# EAGLE design dspic-servo-2 (EAGLE 4.13)
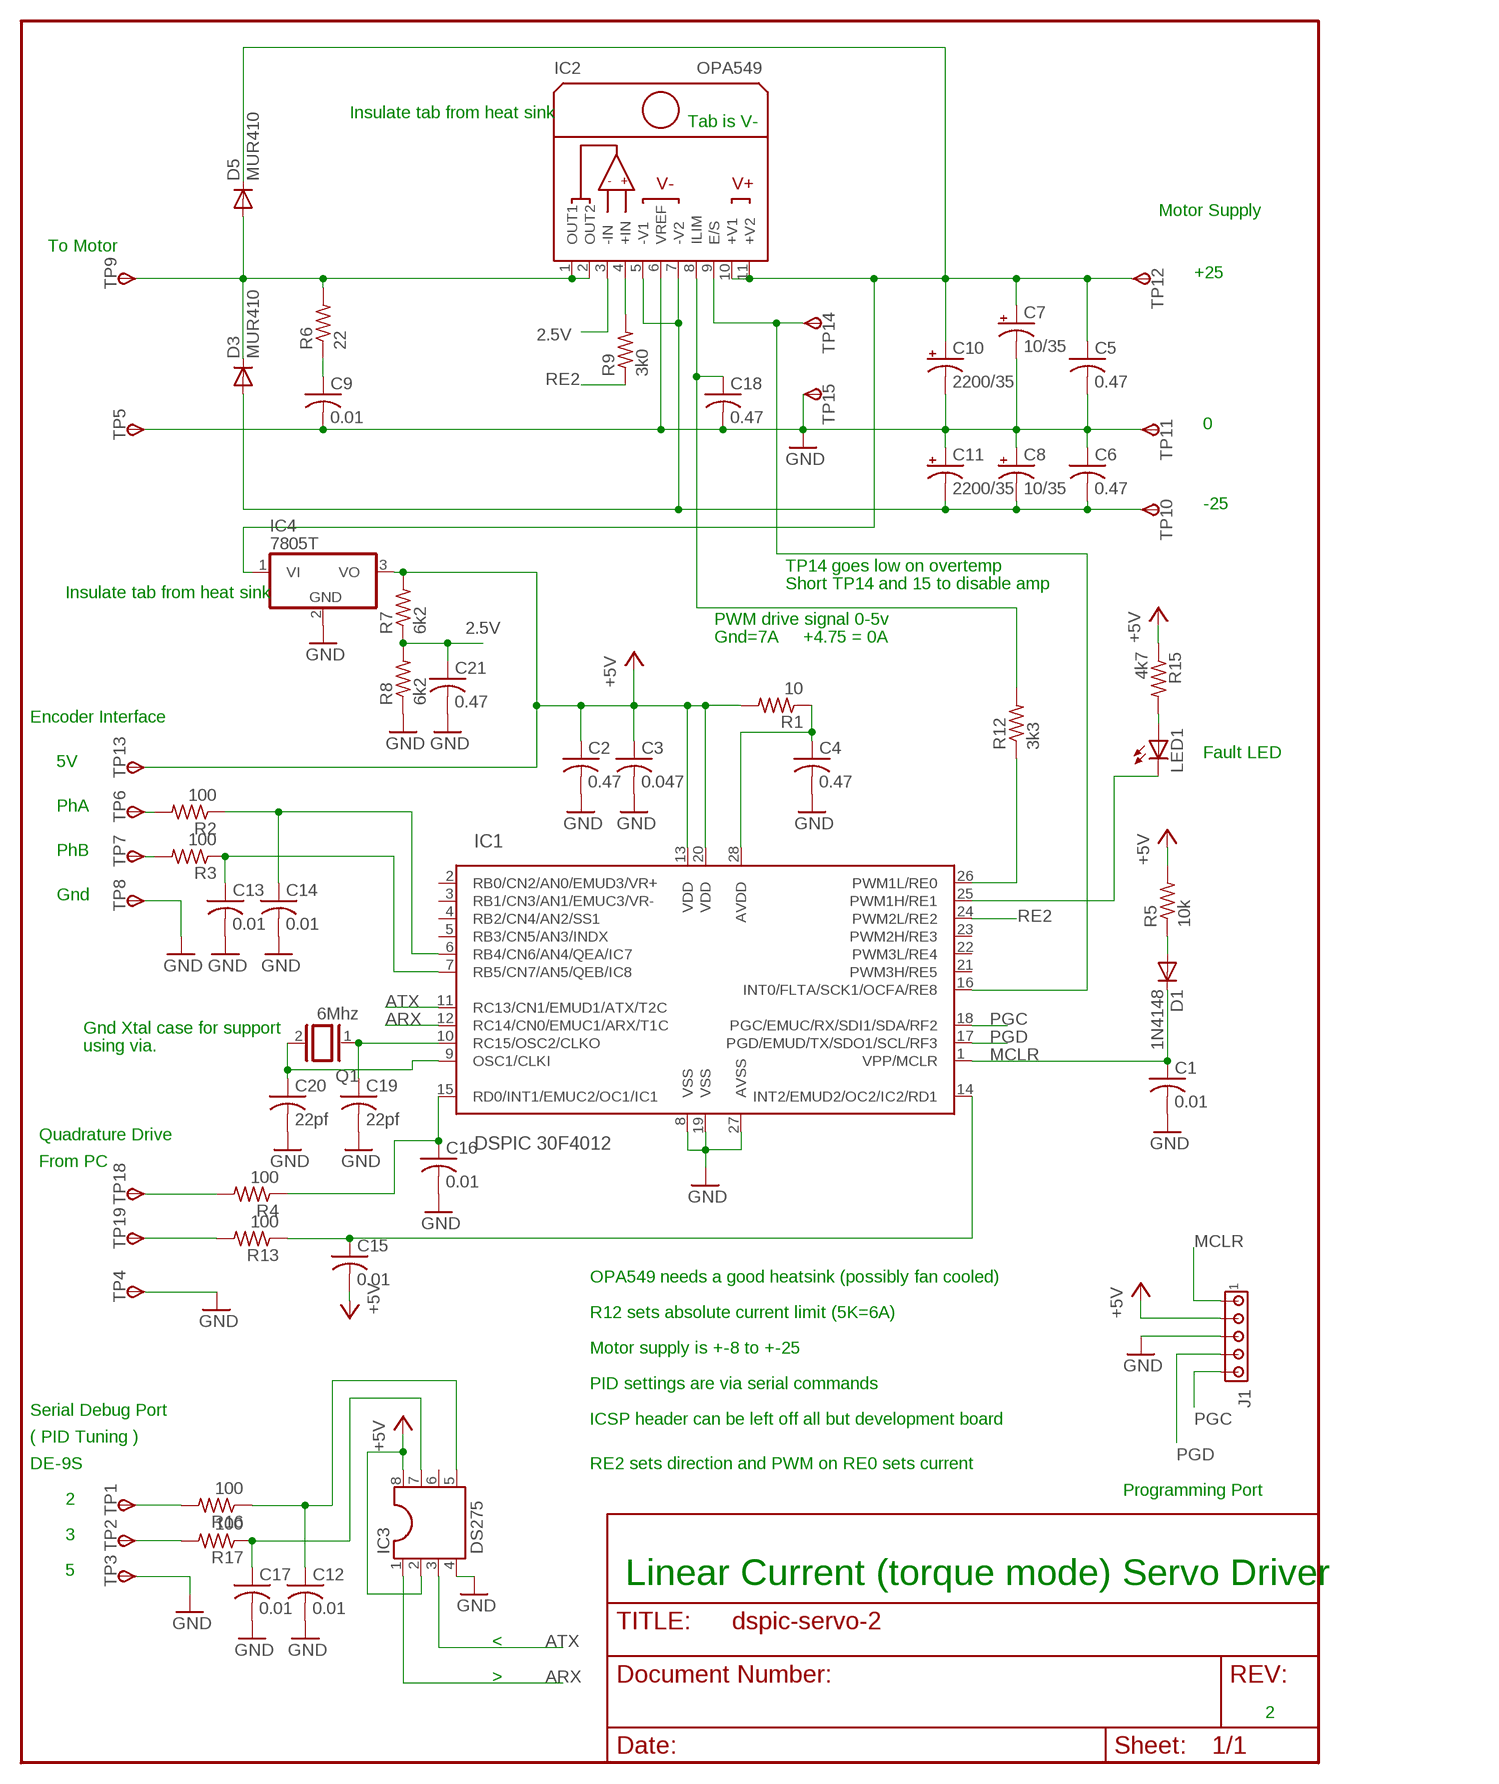
[diagram p0: schematic, sheet 1]

## Parts
C1  0.01  C-USC1206K  [C1206K]
C2  0.47  C-USC1206K  [C1206K]
C3  0.047  C-USC1206K  [C1206K]
C4  0.47  C-USC1206K  [C1206K]
C5  0.47  C-USC1206K  [C1206K]
C6  0.47  C-USC1206K  [C1206K]
C7  10/35  CPOL-USE3.5-10  [E3,5-10]
C8  10/35  CPOL-USE3.5-10  [E3,5-10]
C9  0.01  C-USC1206K  [C1206K]
C10  2200/35  CPOL-USE10-35  [EB35D]
C11  2200/35  CPOL-USE10-35  [EB35D]
C12  0.01  C-USC1206K  [C1206K]
C13  0.01  C-USC1206K  [C1206K]
C14  0.01  C-USC1206K  [C1206K]
C15  0.01  C-USC1206K  [C1206K]
C16  0.01  C-USC1206K  [C1206K]
C17  0.01  C-USC1206K  [C1206K]
C18  0.47  C-USC1206K  [C1206K]
C19  22pf  C-USC1206K  [C1206K]
C20  22pf  C-USC1206K  [C1206K]
C21  0.47  C-USC1206K  [C1206K]
D1  1N4148  [DO35-10]
D3  MUR410  1N5400  [DO201-15]
D5  MUR410  1N5400  [DO201-15]
IC1  DSPIC 30F4012  DSPIC30F2010/SPG  [DIL28-3]
IC2  OPA549  [MULTIWATT-11]
IC3  DS275  DIL8  [DIL08]
IC4  7805T  [TO220H]
J1  MTA05-100  [10X05MTA]
LED1  LED5MM  [LED5MM]
Q1  6Mhz  XTAL  [Q]
R1  10  R-US_R1206  [R1206]
R2  100  R-US_R1206  [R1206]
R3  100  R-US_R1206  [R1206]
R4  100  R-US_R1206  [R1206]
R5  10k  R-US_R1206  [R1206]
R6  22  R-US_R1206  [R1206]
R7  6k2  R-US_R1206  [R1206]
R8  6k2  R-US_R1206  [R1206]
R9  3k0  R-US_R1206  [R1206]
R12  3k3  R-US_R1206  [R1206]
R13  100  R-US_R1206  [R1206]
R15  4k7  R-US_R1206  [R1206]
R16  100  R-US_R1206  [R1206]
R17  100  R-US_R1206  [R1206]
TP1  TPSPAD1-13Y  [P1-13Y]
TP2  TPSPAD1-13Y  [P1-13Y]
TP3  TPSPAD1-13Y  [P1-13Y]
TP4  TPSPAD1-13Y  [P1-13Y]
TP5  TPSPAD1-13Y  [P1-13Y]
TP6  TPSPAD1-13Y  [P1-13Y]
TP7  TPSPAD1-13Y  [P1-13Y]
TP8  TPSPAD1-13Y  [P1-13Y]
TP9  TPSPAD1-17Y  [P1-17Y]
TP10  TPSPAD1-13Y  [P1-13Y]
TP11  TPSPAD1-13Y  [P1-13Y]
TP12  TPSPAD1-13Y  [P1-13Y]
TP13  TPSPAD1-13Y  [P1-13Y]
TP14  TPSPAD1-13Y  [P1-13Y]
TP15  TPSPAD1-13Y  [P1-13Y]
TP18  TPSPAD1-13Y  [P1-13Y]
TP19  TPSPAD1-13Y  [P1-13Y]

## Nets
2.5V: C21.1 IC2.3(-IN) R7.1 R8.2
+5V: C2.1 C3.1 C15.2 IC1.13(VDD) IC1.20(VDD) IC3.2 IC3.8 IC4.3(VO) J1.2 R1.2 R5.2 R7.2 R15.1 TP13.1(PP)
+V1: C5.1 C7.+ C10.+ D5.C IC2.10(+V1) IC2.11(+V2) IC4.1(VI) TP12.1(PP)
-V1: C6.2 C8.- C11.- D3.A IC2.5(-V1) IC2.7(-V2) TP10.1(PP)
ARX: IC1.12(RC14/CN0/EMUC1/ARX/T1C) IC3.1
ATX: IC1.11(RC13/CN1/EMUD1/ATX/T2C) IC3.3
AVDD: C4.1 IC1.28(AVDD) R1.1
GND: C1.2 C2.2 C3.2 C4.2 C5.2 C6.1 C7.- C8.+ C9.2 C10.- C11.+ C12.2 C13.2 C14.2 C16.2 C17.2 C18.2 C19.2 C20.2 C21.2 IC1.8(VSS) IC1.19(VSS) IC1.27(AVSS) IC2.6(VREF) IC3.4 IC4.2(GND) J1.3 R8.1 TP3.1(PP) TP4.1(PP) TP5.1(PP) TP8.1(PP) TP11.1(PP) TP15.1(PP)
MCLR: C1.1 D1.C IC1.1(VPP/MCLR) J1.1
N$1: R13.2 TP19.1(PP)
N$2: C17.1 IC3.7 R17.1
N$3: C12.1 IC3.5 R16.1
N$4: C15.1 IC1.14(INT2/EMUD2/OC2/IC2/RD1) R13.1
N$5: D3.C D5.A IC2.1(OUT1) IC2.2(OUT2) R6.2 TP9.1(PP)
N$6: C9.1 R6.1
N$9: D1.A R5.1
N$10: R4.2 TP18.1(PP)
N$11: IC2.4(+IN) R9.2
N$12: C18.1 IC2.8(ILIM) R12.2
N$13: IC1.16(INT0/FLTA/SCK1/OCFA/RE8) IC2.9(E/S) TP14.1(PP)
N$14: LED1.A R15.2
N$15: IC1.26(PWM1L/RE0) R12.1
N$16: R2.2 TP6.1(PP)
N$17: IC1.25(PWM1H/RE1) LED1.K(C)
N$18: R3.2 TP7.1(PP)
N$19: C13.1 IC1.7(RB5/CN7/AN5/QEB/IC8) R3.1
N$20: C19.1 IC1.10(RC15/OSC2/CLKO) Q1.1
N$21: C14.1 IC1.6(RB4/CN6/AN4/QEA/IC7) R2.1
N$22: C16.1 IC1.15(RD0/INT1/EMUC2/OC1/IC1) R4.1
N$23: C20.1 IC1.9(OSC1/CLKI) Q1.2
N$24: R16.2 TP1.1(PP)
N$25: R17.2 TP2.1(PP)
PGC: IC1.18(PGC/EMUC/RX/SDI1/SDA/RF2) J1.5
PGD: IC1.17(PGD/EMUD/TX/SDO1/SCL/RF3) J1.4
RE2: IC1.24(PWM2L/RE2) R9.1
Unconnected: IC1.2(RB0/CN2/AN0/EMUD3/VR+) IC1.3(RB1/CN3/AN1/EMUC3/VR-) IC1.4(RB2/CN4/AN2/SS1) IC1.5(RB3/CN5/AN3/INDX) IC1.21(PWM3H/RE5) IC1.22(PWM3L/RE4) IC1.23(PWM2H/RE3) IC3.6

## Notes on the sheet
- Insulate tab from heat sink
- Tab is V-
- Motor Supply
- To Motor
- +25
- 0
- -25
- TP14 goes low on overtemp
- Short TP14 and 15 to disable amp
- Insulate tab from heat sink
- PWM drive signal 0-5v
- Gnd=7A | +4.75 = 0A
- Encoder Interface
- Fault LED
- 5V
- PhA
- PhB
- Gnd
- Gnd Xtal case for support
- using via.
- Quadrature Drive
- From PC
- OPA549 needs a good heatsink (possibly fan cooled)
- R12 sets absolute current limit (5K=6A)
- Motor supply is +-8 to +-25
- PID settings are via serial commands
- Serial Debug Port
- ICSP header can be left off all but development board
- ( PID Tuning )
- DE-9S | RE2 sets direction and PWM on RE0 sets current
- Programming Port
- 2
- 3
- 5
- Linear Current (torque mode) Servo Driver
- <
- >
- 2

## Library data of the parts
C1-C6 C9 C12-C21 = rcl:C-US: CAPACITOR, American symbol
C7 C8 C10 C11 = rcl:CPOL-US: POLARIZED CAPACITOR, American symbol
D1 = diode:1N4148: DIODE high speed (Philips)
D3 D5 = diode:1N5400: DIODE standard rectifier, 3 A, 50 V (Motorola)
IC1 = lpg:DSPIC30F2010: dsPIC Motion Controller DSP
IC2 = lpg:OPA549
IC3 = ic-package:DIL8: Dual In Line
IC4 = linear:78*: Positive VOLTAGE REGULATOR
J1 = con-amp:MTA05-100: AMP connector
LED1 = led:LED: LED OSRAM: - CHIPLED LG R971, LG N971, LY N971, LG Q971, LY Q971, LO R971, LY R971 LH N974, LH R974 LS Q976, LO Q976, LY Q976 LO Q996 - Hyper CHIPLED LW Q18S LB Q993, LB Q99A, LB R99A - SideLED LS A670, LO A670, LY A670, LG A670, LP A670 LB A673, LV A673, LT A673, LW A673 LH A674 LY A675 LS A676, LA A676, LO A676, LY A676, LW A676 LS A679, LY A679, LG A679 - Hyper Micro SIDELED® LS Y876, LA Y876, LO Y876, LY Y876 LT Y87S - SmartLED LW L88C, LW L88S LB L89C, LB L89S, LG L890 LS L89K, LO L89K, LY L89K LS L896, LA L896, LO L896, LY L896 - TOPLED LS T670, LO T670, LY T670, LG T670, LP T670 LSG T670, LSP T670, LSY T670, LOP T670, LYG T670 LG T671, LOG T671, LSG T671 LB T673, LV T673, LT T673, LW T673 LH T674 LS T676, LA T676, LO T676, LY T676, LB T676, LH T676, LSB T676, LW T676 LB T67C, LV T67C, LT T67C, LS T67K, LO T67K, LY T67K, LW E67C LS E67B, LA E67B, LO E67B, LY E67B, LB E67C, LV E67C, LT E67C LW T67C LS T679, LY T679, LG T679 LS T770, LO T770, LY T770, LG T770, LP T770 LB T773, LV T773, LT T773, LW T773 LH T774 LS E675, LA E675, LY E675, LS T675 LS T776, LA T776, LO T776, LY T776, LB T776 LHGB T686 LT T68C, LB T68C - Hyper Mini TOPLED® LB M676 - Mini TOPLED Santana® LG M470 LS M47K, LO M47K, LY M47K Source: http://www.osram.convergy.de/
Q1 = special:XTAL: CRYSTAL
R1-R9 R12 R13 R15-R17 = rcl:R-US_: RESISTOR, American symbol
TP1-TP15 TP18 TP19 = testpad:TPS: TEST PIN

## Board
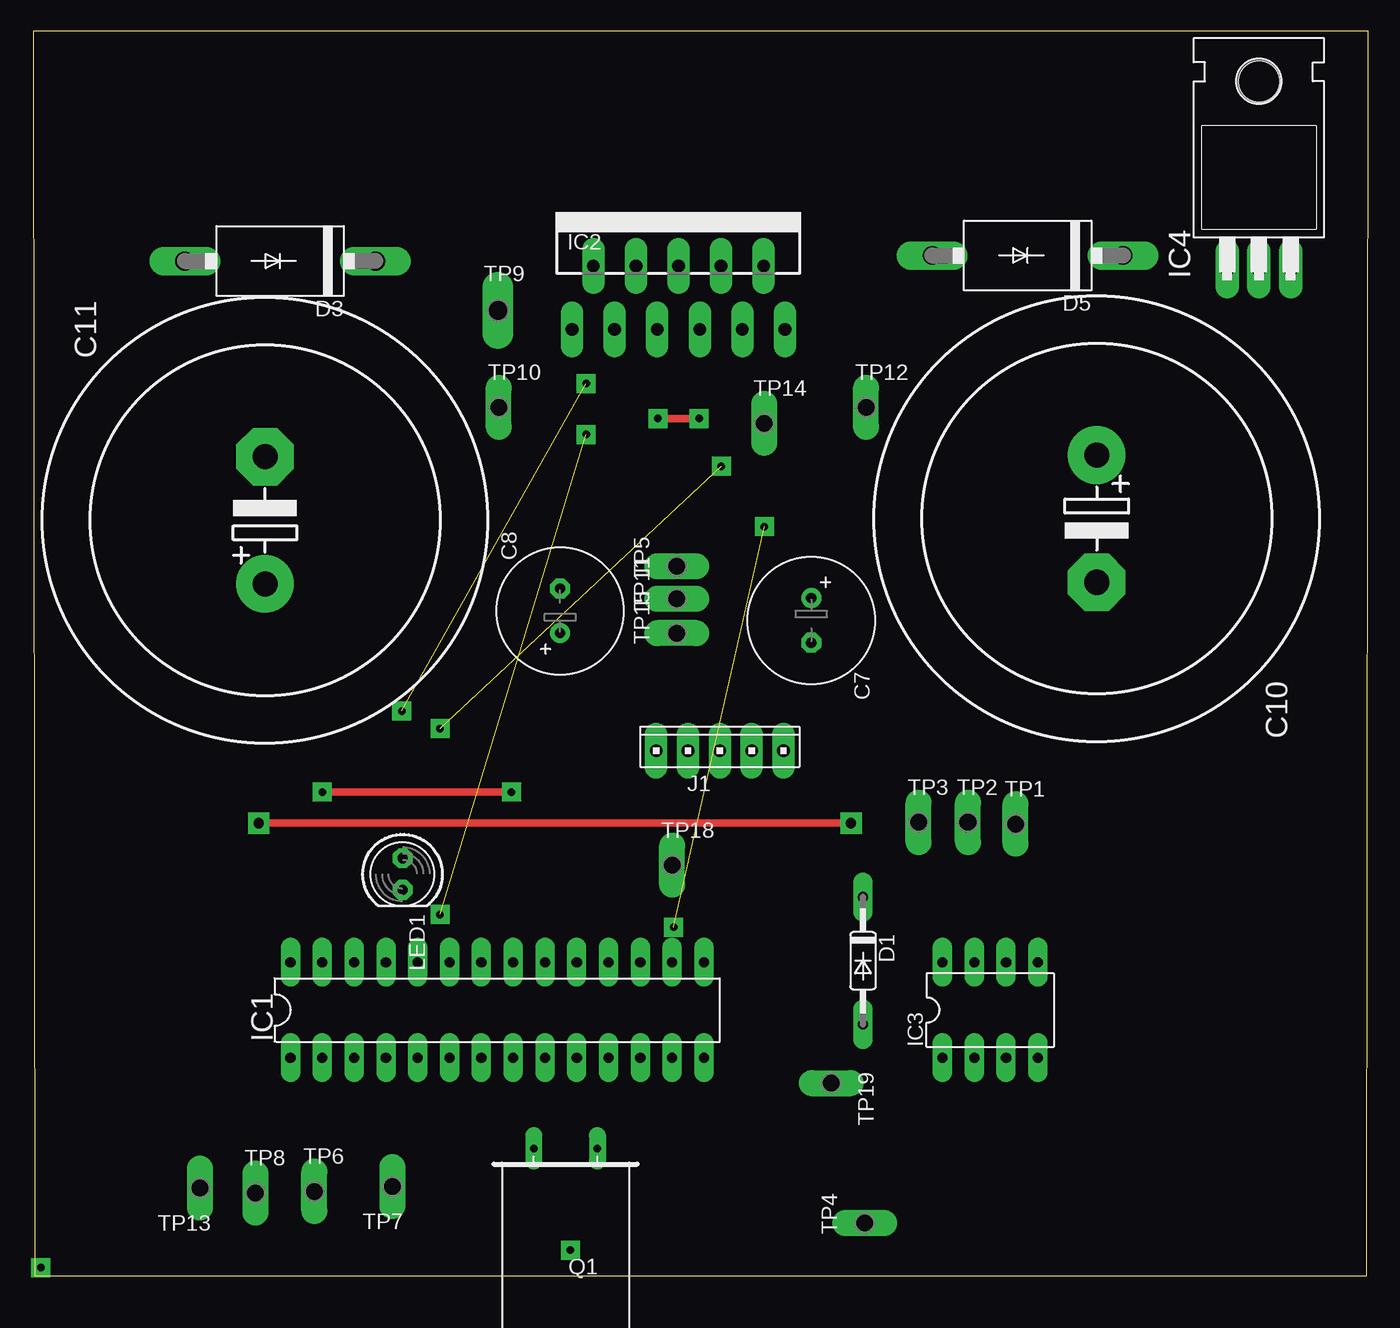
[diagram p1: board, top side]
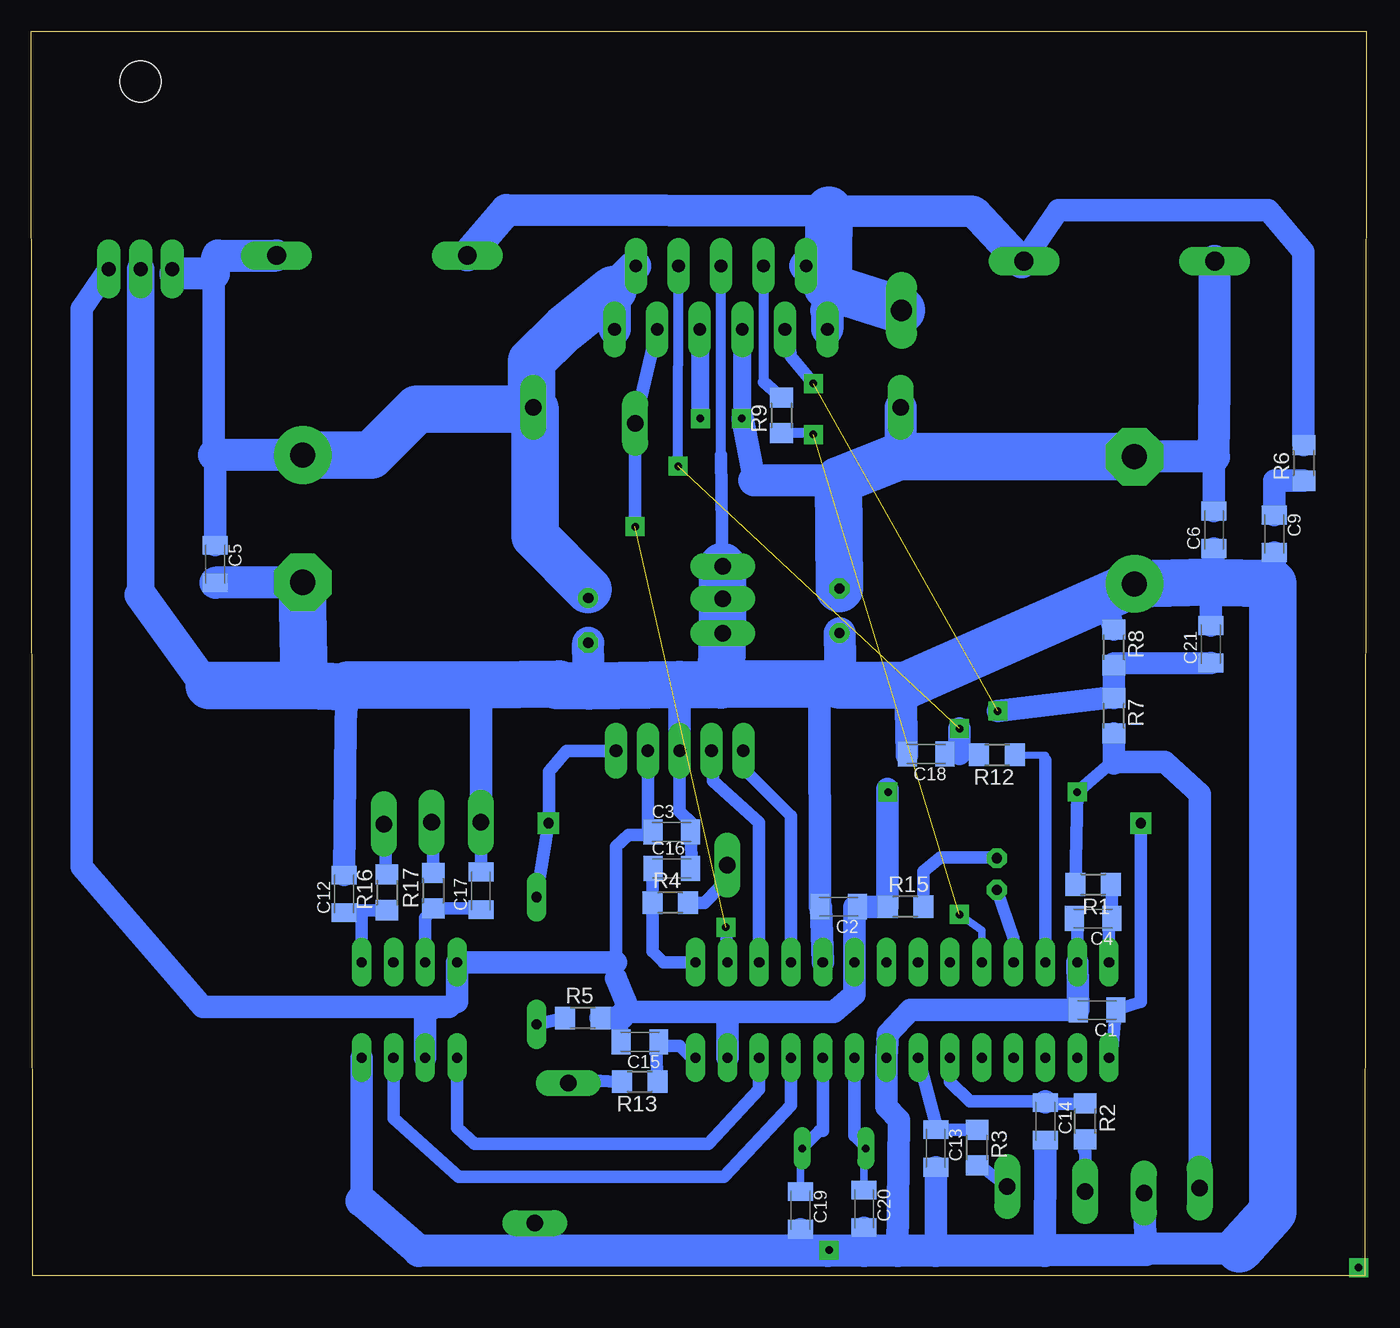
[diagram p2: board, bottom side, seen from below]

Size 106.6 x 99.37 mm. Coordinates in mm from the lower left corner, seen from the top.
Outline: 0.13,0 106.48,0 106.6,99.37 0,99.37 0.13,0
Copper layers (1*16): Top 0.035mm / dielectric 1.5mm / Bottom 0.035mm
Design rules "pcb-gcode-lpg": minimum track width 24mil, minimum drill 22mil, track to track 20mil, track to pad 20mil, pad to pad 10mil, via to via 8mil, smd to smd 8mil, copper to edge 40mil, drill to drill 30mil, minimum pad ring 15mil, minimum via ring 18mil, stop-mask expansion 4mil, vias tented up to drill 0mil, thermal gap 10mil

### Footprints (pad centres in the part's own frame; a part is rotated, then mirrored left to right if it is on the bottom)
C1206K = smd 1.5 x 2: 1 -1.5,0; 2 1.5,0
E3,5-10 = drill 0.813 pad 1.6 round: + -1.778,0 | drill 0.813 pad 1.6 octagon: - 1.778,0
EB35D = drill 2.007 pad 4.597 round: + -5.08,0 | drill 2.007 pad 4.597 octagon: - 5.08,0
DO35-10 = drill 0.813 long: A 5.08,0; C -5.08,0
DO201-15 = drill 1.499 long: A 7.62,0; C -7.62,0
DIL28-3 = drill 0.813 long: 1 -16.51,-3.81; 2 -13.97,-3.81; 3 -11.43,-3.81; 4 -8.89,-3.81; 5 -6.35,-3.81; 6 -3.81,-3.81; 7 -1.27,-3.81; 8 1.27,-3.81; 9 3.81,-3.81; 10 6.35,-3.81; 11 8.89,-3.81; 12 11.43,-3.81; 13 13.97,-3.81; 14 16.51,-3.81; 15 16.51,3.81; 16 13.97,3.81; 17 11.43,3.81; 18 8.89,3.81; 19 6.35,3.81; 20 3.81,3.81; 21 1.27,3.81; 22 -1.27,3.81; 23 -3.81,3.81; 24 -6.35,3.81; 25 -8.89,3.81; 26 -11.43,3.81; 27 -13.97,3.81; 28 -16.51,3.81
MULTIWATT-11 = drill 1.016 long: 1 -8.5,-6.35; 2 -6.8,-1.27; 3 -5.1,-6.35; 4 -3.4,-1.27; 5 -1.7,-6.35; 6 0,-1.27; 7 1.7,-6.35; 8 3.4,-1.27; 9 5.1,-6.35; 10 6.8,-1.27; 11 8.5,-6.35
DIL08 = drill 0.813 long: 1 -3.81,-3.81; 2 -1.27,-3.81; 3 1.27,-3.81; 4 3.81,-3.81; 5 3.81,3.81; 6 1.27,3.81; 7 -1.27,3.81; 8 -3.81,3.81
TO220H = drill 1.118 long: 1 -2.54,-10.16; 2 0,-10.16; 3 2.54,-10.16 | hole 3.302: 0,4.826
10X05MTA = drill 1.016 long: 1 5.08,0; 2 2.54,0; 3 0,0; 4 -2.54,0; 5 -5.08,0
LED5MM = drill 0.813 octagon: A -1.27,0; K 1.27,0
Q = drill 0.61 long: 1 -2.54,-7.62; 2 2.54,-7.62
R1206 = smd 1.6 x 1.803: 1 -1.422,0; 2 1.422,0
P1-13Y = drill 1.321 pad 1.905 long: 1 0,0
P1-17Y = drill 1.702 pad 2.121 long: 1 0,0

### Placement (x,y rotation side)
C1  21.49,21.2 180 bottom
C2  42.13,29.46 180 bottom
C3  55.46,35.43 0 bottom
C4  21.81,28.51 180 bottom
C5  91.91,56.83 270 bottom
C6  12.15,59.56 90 bottom
C7  62.13,52.32 270 top
C8  42.06,53.08 90 top
C9  7.33,59.24 270 bottom
C10  84.92,60.45 270 top
C11  18.5,60.32 90 top
C12  81.62,30.47 90 bottom
C13  34.38,10.16 270 bottom
C14  25.62,12.31 270 bottom
C15  58,18.66 180 bottom
C16  55.46,32.51 0 bottom
C17  70.7,30.73 90 bottom
C18  35.14,41.65 180 bottom
C19  45.17,5.2 270 bottom
C20  40.09,5.33 270 bottom
C21  12.41,50.41 90 bottom
D1  66.26,25.14 270 top
D3  19.71,81.02 180 top
D5  79.4,81.47 180 top
IC1  37.05,21.2 0 top
IC2  51.52,81.91 0 top
IC3  76.42,21.2 0 top
IC4  97.88,90.55 0 top
J1  54.83,41.91 0 top
LED1  29.49,32.06 270 top
Q1  42.51,2.54 180 top
R1  21.81,31.24 180 bottom
R2  22.44,12.31 270 bottom
R3  31.08,10.22 270 bottom
R4  55.59,29.78 0 bottom
R5  62.57,20.57 0 bottom
R6  4.98,64.89 90 bottom
R7  20.16,44.7 270 bottom
R8  20.16,50.16 270 bottom
R9  46.7,68.7 90 bottom
R12  29.49,41.59 180 bottom
R13  58,15.49 180 bottom
R15  36.79,29.46 0 bottom
R16  78.19,30.6 90 bottom
R17  74.51,30.73 90 bottom
TP1  78.45,36.06 0 top
TP2  74.64,36.19 0 top
TP3  70.7,36.19 0 top
TP4  66.38,4.19 90 top
TP5  51.4,56.64 90 top
TP6  22.44,6.73 0 top
TP7  28.66,7.11 180 top
TP8  17.74,6.6 0 top
TP9  37.11,77.08 0 top
TP10  37.17,69.34 0 top
TP11  51.4,54.03 90 top
TP12  66.51,69.34 0 top
TP13  13.3,6.98 180 top
TP14  58.38,68.07 0 top
TP15  51.4,51.3 90 top
TP18  51.02,32.76 0 top
TP19  63.72,15.36 270 top

### Tracks (layer width: path | path; a pad name or v marks a point on that pad's centre or on a via)
2.5V  (via drill 0.6)  (1 unrouted)
  Bottom 0.61: 46.32,75.43 IC2.3 46.32,75.69
  Bottom 1.016: v44.16,71.24 45.94,73.4 46.32,75.69
  Bottom 1.778: C21.1 20.16,48.89 | 20.16,46.22 R7.1 | 20.16,46.22 v29.43,45.08 | 20.16,48.89 R8.2 | 20.16,48.89 20.16,46.22
+5V  (via drill 0.6)
  Top 0.61: v23.08,38.6 v38.19,38.6
  Bottom 0.61: C2.1 40.86,29.46
  Bottom 1.016: 59.91,23.74 59.91,25.01 59.91,34.29 58.89,35.17 57.75,35.17 | 75.15,20.57 73.22,21.53 73.22,21.43 | 59.16,21.88 59.4,20.57 59.32,21.11 C15.2 | 57.37,39.3 J1.2 57.37,35.43 57.75,35.17 | IC1.20 40.73,25.01 | C2.1 40.73,29.46 | 73.22,21.43 73.11,21.33 | 73.22,21.43 73.24,21.46 | 57.75,35.17 C3.1 | R1.2 v23.08,38.6 20.16,41.14 20.16,41.02 | 38.21,38.86 38.19,38.86 v38.19,38.6
  Bottom 1.778: 59.16,21.88 59.91,23.74 | 73.22,21.53 72.61,21.84 IC3.8 59.91,25.01 | 75.15,20.57 IC3.2 | 59.4,20.57 R5.2 | IC1.13 51.02,21.08 51.27,21.08 | 59.32,21.11 58.92,21.11 58.89,21.08 51.27,21.08 | 20.16,41.02 16.09,41.02 13.3,38.48 TP13.1 | C2.1 R15.1 38.21,38.86 | IC4.3 102.58,77.21 102.58,32.63 92.93,21.46 73.24,21.46 | 40.86,29.46 IC1.20 40.86,22.47 42.51,21.08 51.27,21.08 | 20.16,41.02 20.16,40.89 | 20.16,41.02 R7.2
+V1
  Bottom 0.61: 92.04,65.53 91.97,65.46 92.04,65.4 | IC4.1 95.34,80.26 95.08,80 | 60.02,78.98 60.16,79.12 59.91,79.12 | 58.38,80.64 IC2.10 | 66.89,69.21 66.64,69.46 TP12.1 66.38,69.21 | C7.+ 62.13,54.8
  Bottom 1.422: 60.16,78.73 60.02,78.73
  Bottom 1.778: 91.91,65.53 C5.1 | 92.04,65.53 92.04,80
  Bottom 2.54: C10.+ 91.91,65.53 92.04,65.53 | D5.C 91.72,81.46 92.04,80 95.08,80 | IC2.11 60.02,78.73 60.02,78.98 | 59.91,79.12 58.38,80.64
  Bottom 3.81: C10.+ 79.46,65.53 75.78,69.21 66.89,69.21 | 66.64,69.46 66.64,73.02 64.1,75.56 60.16,78.73 | 62.13,54.8 66.38,59.05 66.38,69.21
-V1  (via drill 0.6)
  Top 0.61: v49.87,68.45 v53.18,68.45
  Bottom 0.61: 49.82,68.5 v49.87,68.45 | 53.18,75.56 IC2.7 | 37.3,65.4 37.17,65.4
  Bottom 1.422: 49.82,68.5 IC2.5 | v53.18,68.45 53.18,75.56
  Bottom 1.778: C6.2 12.15,65.4 | 48.86,63.5 49.82,68.5
  Bottom 2.54: C11.- 12.15,65.4 12.09,70.92 D3.A | 37.17,65.4 TP10.1 | 42.13,63.5 48.86,63.5
  Bottom 3.81: C11.- 37.3,65.4 42.13,63.5 C8.-
ARX
  Bottom 1.016: IC1.12 48.48,14.85 52.54,10.54 71.21,10.54 72.61,11.81 IC3.1
ATX
  Bottom 1.016: IC1.11 45.94,13.58 51.27,7.87 72.48,7.87 77.69,12.57 IC3.3
AVDD
  Bottom 1.016: IC1.28 20.54,28.51 C4.1 20.31,31.26 20.38,31.34 | 20.38,31.34 20.41,31.36 | 20.38,31.34 R1.1
GND
  Bottom 0.305: IC2.6 51.65,80.64
  Bottom 0.61: 81.5,44.19 81.37,46.98 81.37,44.32 | 81.5,44.06 81.87,44.06 82,44.19 | 84.96,55.33 C10.- | 7.22,55.26 7.2,55.24 | 36.66,41.52 C18.2
  Bottom 0.813: 25.62,10.09 C14.2 | 51.52,65.53 IC2.6
  Bottom 1.016: 25.68,2.03 25.68,1.96 | C4.2 23.08,28.51 IC1.27 | 70.7,32.13 C17.2 TP3.1 | J1.3 54.83,37.08 53.81,36.06 53.81,34.79 C3.2 53.83,32.4 53.81,32.38 C16.2 | 66.89,1.9 | 66.89,1.99 66.89,1.9 | TP4.1 66.38,2.41 66.89,1.9 | 37.43,1.96 37.3,1.65 | TP5.1 51.52,65.53
  Bottom 1.778: 80.23,5.96 IC3.4 | 25.62,10.09 25.68,2.03 25.36,2.03 | 34.38,1.96 C13.2 | C12.2 81.5,44.06 81.5,44.19 81.5,44.32 81.31,47.18 | TP8.1 17.62,2.03 17.62,2.15 | 40.09,1.96 C20.2 | 45.05,1.99 45.05,1.9 45.17,2.03 C19.2 | 37.43,1.96 37.3,12.44 38.32,13.46 IC1.8 38.19,19.3 36.41,21.2 C1.2 IC1.27 | 7.2,55.24 C9.2 | 36.79,47.11 36.66,41.52 | 64.99,47.11 64.6,47.11 64.48,47.24 | 54.83,47.2 54.83,44.57 J1.3 | 70.7,47.18 TP3.1 | 92.42,47.11 92.54,46.98 | 62.07,47.1 62.07,46.98 | C8.+ 42,51.3 42.06,47.18 | 43.27,47.24 43.27,47.11 | IC1.19 43.52,29.46 C2.2 43.65,47.37 43.52,47.24 | 7.46,55.26 7.46,55.49 | 12.28,55.36 12.28,55.37 C6.1 | 12.41,55.36 12.41,55.37 C21.2 | 20.92,54.22 20.9,54.18 | 20.92,54.22 R8.1 | C11.+ 20.92,54.22
  Bottom 2.184: 97.88,54.35 IC4.2
  Bottom 2.54: 80.23,5.96 75.65,1.96 66.89,1.99 45.05,1.99 43.02,1.96 40.09,1.96 37.43,1.96 34.38,1.96 25.68,1.96 | 17.62,2.03 25.36,2.03 | 51.52,47.18 51.52,47.23 51.65,47.24 | 92.54,46.98 97.88,54.35 | 84.96,55.33 C5.2 | 7.46,55.26 7.22,55.26 | 62.07,46.98 C7.- | C8.+ 42,47.24 43.27,47.24 43.52,47.24 | 10.12,2.15 17.62,2.15 | 12.28,55.36 12.41,55.36 12.66,55.37
  Bottom 3.81: 81.31,47.18 70.7,47.18 64.48,47.24 | 51.52,47.23 TP15.1 TP11.1 TP5.1 | 42.06,47.18 36.79,47.11 C11.+ 12.66,55.37 | 51.52,47.18 54.83,47.2 62.07,47.1 64.6,47.11 | 81.37,46.98 84.8,47.11 | 84.8,47.11 92.42,47.11 | 84.8,47.11 84.96,55.33 | 43.52,47.24 51.65,47.24 | 10.12,2.15 7.46,5.08 7.46,55.26 12.28,55.36
MCLR  (via drill 0.8)
  Top 0.61: v18,36.13 v65.3,36.13
  Bottom 0.61: v65.3,36.13 65.24,36.19
  Bottom 1.016: IC1.1 20.31,17.62 C1.1 18,21.84 v18,36.13 | v65.3,36.13 D1.C | J1.1 63.84,41.91 65.24,40.25 65.24,36.19
N$1
  Bottom 1.016: TP19.1 62.32,15.62 59.91,15.49 R13.2
N$2
  Bottom 1.016: IC3.7 75.15,28.57 74.51,29.2 R17.1 70.6,29.31 | 70.6,29.31 70.68,29.23 C17.1 | 70.6,29.31 70.57,29.33
N$3
  Bottom 1.016: R16.1 81.62,29.18 C12.1 80.23,28.97 IC3.5 80.23,24.89
N$4
  Bottom 1.016: R13.1 56.73,18.03 C15.1 56.5,18.43 56.41,18.35 54.83,18.35 53.87,17.39 IC1.14
N$5
  Bottom 0.61: 44.79,80.64 44.67,80.51 | 43.02,78.85 43.02,78.86 | 44.79,80.64 IC2.2 | 44.79,80.64 44.92,82.04
  Bottom 1.778: 27.39,81.02 24.6,85.08 7.84,85.08 5.04,81.78 5.04,66.42 R6.2
  Bottom 2.54: 43.02,77.08 IC2.1 42.95,80.76 | 43.02,77.08 43.02,78.85 | 43.02,78.86 44.79,80.64 | D5.A 68.67,85.08 42.89,85 | 27.39,81.02 D3.C 27.52,80.89 31.33,84.96 42.89,85 | 42.89,85 42.89,85.08 | 43.02,77.08 43.14,77.08
  Bottom 3.81: 42.89,85.08 42.95,80.76 43.02,78.99 TP9.1
N$6
  Bottom 1.778: C9.1 7.33,63.5 R6.1
N$7  (via drill 0.6)
  other vias: 0.6,0.63
N$8  (via drill 0.6)
  other vias: 42.89,2.03
N$9
  Bottom 1.016: R5.1 D1.A
N$10
  Bottom 1.016: R4.2 52.86,29.78 51.65,30.98 TP18.1
N$11
  Bottom 0.305: 48.09,80.64 IC2.4 | R9.2 46.7,70.1
  Bottom 0.813: 48.09,71.37 48.09,80.64
  Bottom 1.016: 46.7,70.1 48.09,71.37
N$12  (via drill 0.6)  (1 unrouted)
  Bottom 0.61: 33.74,41.65 C18.1 | R12.2 33.74,41.65 | 33.74,41.65 32.47,41.65
  Bottom 0.813: v54.95,64.64 IC2.8
  Bottom 1.778: 32.47,41.65 v32.47,43.68
N$13  (via drill 0.6)  (1 unrouted)
  Bottom 1.016: IC2.9 TP14.1 v58.38,59.81 | IC1.16 v51.14,27.81
N$14
  Bottom 1.016: 29.55,33.27 LED1.A 29.49,33.59 29.43,33.4 34,33.4 35.37,32.28 R15.2
N$15
  Bottom 0.61: 25.62,41.14 25.62,41.52 R12.1
  Bottom 1.016: IC1.26 25.62,41.14
N$16
  Bottom 1.016: TP6.1 22.44,9.9 22.54,10 R2.2
N$17
  Bottom 1.016: IC1.25 28.16,26.98 LED1.K
N$18
  Bottom 1.016: TP7.1 31.2,9.08 R3.2
N$19
  Bottom 1.016: R3.1 34.25,11.66 | 34.25,11.66 C13.1 | 34.25,11.66 IC1.7
N$20
  Bottom 0.61: Q1.1 45.17,10.41 C19.1
  Bottom 1.016: IC1.10 43.4,11.55 43.65,11.55 Q1.1
N$21
  Bottom 0.813: 22.44,13.9 R2.1 22.44,13.71 | 25.93,13.58 25.93,13.71 25.93,13.81 C14.1
  Bottom 1.016: 22.44,13.71 25.93,13.71 | IC1.6 33.24,15.49 31.65,13.9 25.62,13.9
  Bottom 1.778: C14.1 25.62,13.9
N$22
  Bottom 0.61: 56.98,29.71 R4.1
  Bottom 1.016: IC1.15 56.1,25.01 56.98,25.9 56.98,29.71 | C16.1 56.83,32.28 57.01,32.1 R4.1
N$23
  Bottom 0.61: Q1.2 40.09,10.41 C20.1
  Bottom 1.016: Q1.2 39.97,10.28 40.09,10.41 40.86,11.17 IC1.9
N$24
  Bottom 0.406: 78.32,36.06 TP1.1
  Bottom 1.016: 78.32,32.02 78.32,32 | R16.2 78.32,32.02 | 78.32,32.02 78.32,36.06
N$25
  Bottom 1.016: 74.51,31.87 R17.2 74.51,36.19 TP2.1
PGC
  Bottom 1.016: J1.5 49.75,40.51 45.94,36.7 IC1.18
PGD
  Bottom 1.016: J1.4 52.16,39.49 48.48,36.19 IC1.17
RE2  (via drill 0.6)  (1 unrouted)
  Bottom 0.61: IC1.24 30.7,27.55 v32.47,28.82
  Bottom 0.813: R9.1 44.26,67.28 v44.16,67.18